# Altium schematic sheet EC_Circuit4-4-2016.SchDoc
size A
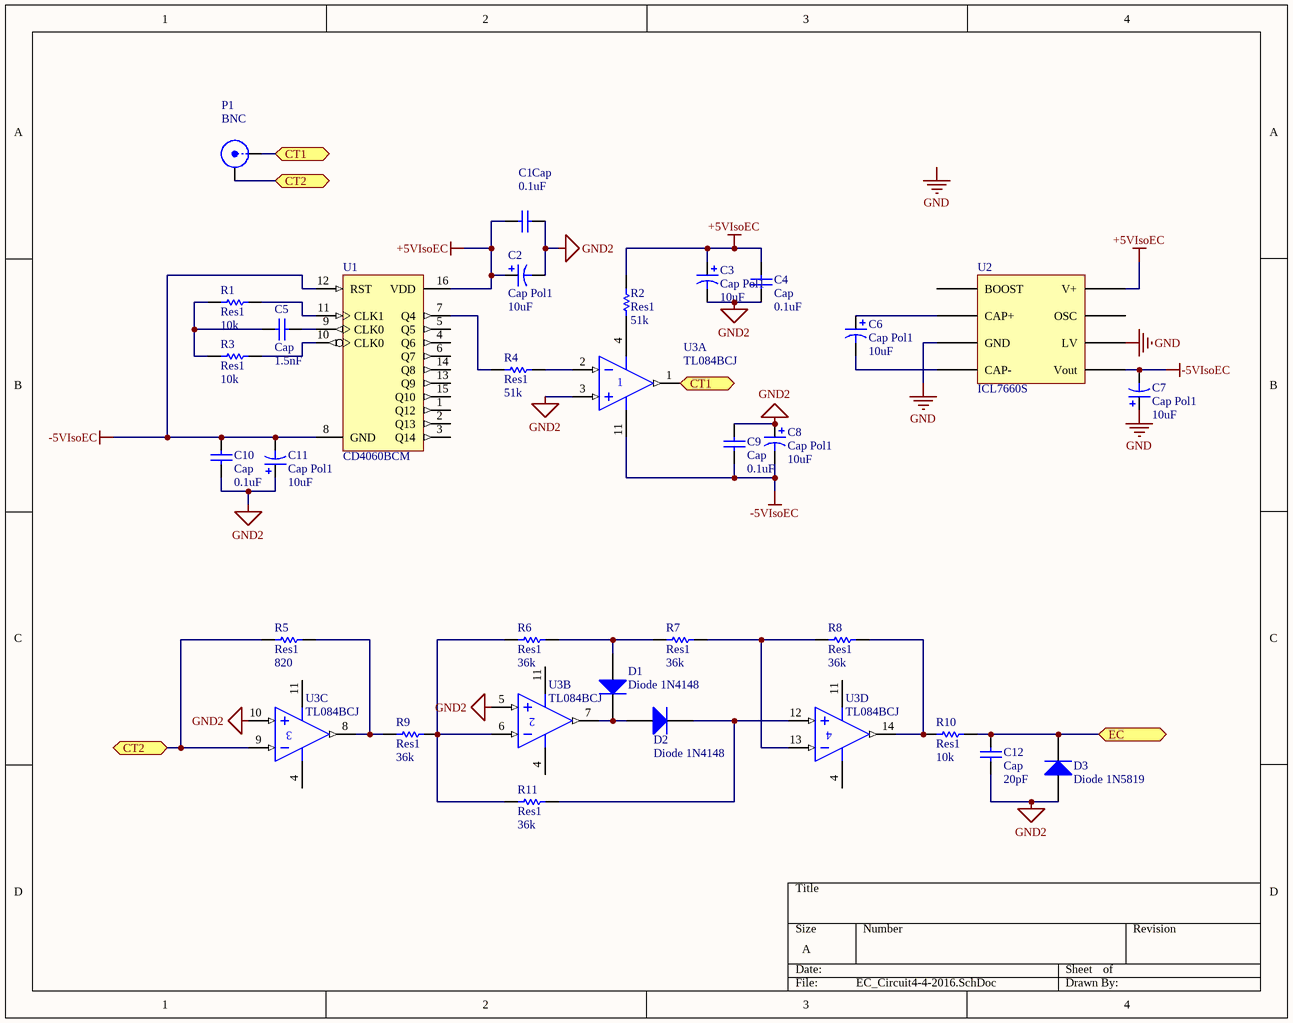
[diagram p0: EC_Circuit4-4-2016.SchDoc]

## Parts
C1  Cap  value 0.1uF  [RESC2012L]
C2  Cap Pol1  value 10uF  [CAPC3216L]
C3  Cap Pol1  value 10uF  [CAPC3216L]
C4  Cap  value 0.1uF  [RESC2012L]
C5  Cap  value 1.5nF  [RESC2012L]
C6  Cap Pol1  value 10uF  [CAPC3216L]
C7  Cap Pol1  value 10uF  [CAPC3216L]
C8  Cap Pol1  value 10uF  [CAPC3216L]
C9  Cap  value 0.1uF  [RESC2012L]
C10  Cap  value 0.1uF  [RESC2012L]
C11  Cap Pol1  value 10uF  [CAPC3216L]
C12  Cap  value 20pF  [RESC2012L]
D1  Diode 1N4148  [SOD123/X.85]
D2  Diode 1N4148  [SOD123/X.85]
D3  Diode 1N5819  [SOD123/X.85]
P1  BNC  [BNC_RA CON]
R1  Res1  value 10k  [RESC2012L]
R2  Res1  value 51k  [RESC2012L]
R3  Res1  value 10k  [RESC2012L]
R4  Res1  value 51k  [RESC2012L]
R5  Res1  value 820  [RESC2012L]
R6  Res1  value 36k  [RESC2012L]
R7  Res1  value 36k  [RESC2012L]
R8  Res1  value 36k  [RESC2012L]
R9  Res1  value 36k  [RESC2012L]
R10  Res1  value 10k  [RESC2012L]
R11  Res1  value 36k  [RESC2012L]
U1  CD4060BCM  [M16A_N]
U2  ICL7660S  [SOIC127P600-8M]
U3  TL084BCJ  [NSO14_M]  (parts A,B,C,D of 4)

## Ports
CT1, CT2, EC

## Nets
+5VIsoEC: C1.1 C2.1 C3.1 C4.1 R2.2 U1.16(VDD) U2.8(V+)
-5VIsoEC: C7.2 C8.2 C9.2 C10.2 C11.2 U1.8(GND) U1.12(RST) U2.5(Vout) U3.11(V-)
GND: C7.1 U2.3(GND) U2.6(LV)
GND2: C1.2 C2.2 C3.2 C4.2 C8.1 C9.1 C10.1 C11.1 C12.2 D3.1(A) U3.3(IN+) U3.5(IN+) U3.10(IN+)
CT1: P1.1(X) U3.1(OUT) ; port CT1
CT2: P1.2(Y) R5.1 U3.9(IN-) ; port CT2
EC: C12.1 D3.2(K) R10.2 ; port EC
NetC5_1: C5.1 R1.1 R3.1
NetC5_2: C5.2 U1.9(CLK0)
NetC6_1: C6.1 U2.2(CAP+)
NetC6_2: C6.2 U2.4(CAP-)
NetD1_1: D1.1(A) R6.2 R7.1
NetD1_2: D1.2(K) D2.1(A) U3.7(OUT)
NetD2_2: D2.2(K) R11.2 U3.12(IN+)
NetR1_2: R1.2 U1.11(CLK1)
NetR2_1: R2.1 U3.4(V+)
NetR3_2: R3.2 U1.10(CLK0)
NetR4_1: R4.1 U1.7(Q4)
NetR4_2: R4.2 U3.2(IN-)
NetR5_2: R5.2 R9.1 U3.8(OUT)
NetR6_1: R6.1 R9.2 R11.1 U3.6(IN-)
NetR7_2: R7.2 R8.1 U3.13(IN-)
NetR8_2: R8.2 R10.1 U3.14(OUT)

Not connected (* = marked no-connect by the designer): U1 1(Q12) 2(Q13) 3(Q14) 4(Q6) 5(Q5) 6(Q7) 13(Q9) 14(Q8) 15(Q10); U2 1(BOOST) 7(OSC)

## Notes on the sheet
- Labels drawn without touching a wire or pin: GND

## Library data of the parts
C1 C4 C5 C9 C10 C12 = Cap: Capacitor; Published: 8-Jun-2000; LatestRevisionDate: 17-Jul-2002; LatestRevisionNote: Re-released for DXP Platform.; PackageReference: RAD-0.3; Publisher: Altium Limited
C2 C3 C6-C8 C11 = Cap Pol1: Polarized Capacitor (Radial); Published: 8-Jun-2000; LatestRevisionDate: 17-Jul-2002; LatestRevisionNote: Re-released for DXP Platform.; PackageReference: RB7.6-15; Publisher: Altium Limited
D1 D2 = Diode 1N4148: High Conductance Fast Diode; Published: 8-Jun-2000; LatestRevisionDate: 17-Jul-2002; LatestRevisionNote: Re-released for DXP Platform.; DatasheetVersion: 1997; PackageReference: DO-35; Publisher: Altium Limited; Code_JEDEC: DO-204-AH; ComponentLink1Description: Manufacturer Link; ComponentLink1URL: http://www.fairchildsemi.com/; ComponentLink2Description: Datasheet; ComponentLink2URL: http://www.fairchildsemi.com/ds/1N%2F1N4148.pdf
D3 = Diode 1N4001: 1 Amp General Purpose Rectifier; Published: 8-Jun-2000; LatestRevisionDate: 17-Jul-2002; LatestRevisionNote: Re-released for DXP Platform.; DatasheetVersion: 1998; PackageVersion: Aug-1999; PackageReference: DO-41; Publisher: Altium Limited; Code_JEDEC: DO-204-AL; ComponentLink1Description: Manufacturer Link; ComponentLink1URL: http://www.fairchildsemi.com/; ComponentLink2Description: Datasheet; ComponentLink2URL: http://www.fairchildsemi.com/ds/1N%2F1N4001.pdf
P1 = BNC: BNC Elbow Connector; LatestRevisionDate: 17-Jul-2002; LatestRevisionNote: Re-released for DXP Platform.; Publisher: Altium Limited
R1-R11 = Res1: Resistor; Published: 8-Jun-2000; LatestRevisionDate: 17-Jul-2002; LatestRevisionNote: Re-released for DXP Platform.; PackageReference: AXIAL-0.3; Publisher: Altium Limited
U1 = CD4060BCM: 14-Stage Ripple Carry Binary Counter; Published: 17-Jul-2002; LatestRevisionDate: 13-Apr-2006; LatestRevisionNote: IPC-7351 Footprint Added.; DatasheetVersion: Jan-1999; PackageVersion: 2000; PackageReference: M16A; Publisher: Altium Limited; PackageDescription: 16-Pin Small Outline Integrated Circuit 1.27 mm Pitch; Code_IPC: SOIC127P600-16; ComponentLink1Description: Manufacturer Link; ComponentLink1URL: http://www.fairchildsemi.com/; ComponentLink2Description: Datasheet; ComponentLink2URL: http://www.fairchildsemi.com/ds/CD%2FCD4040BC.pdf
U3 = TL084BCJ: JFET-Input Operational Amplifier; Published: 17-Jul-2002; LatestRevisionDate: 06-Jun-2005; LatestRevisionNote: Stylized 3D Model Added.; DatasheetVersion: 1988; PackageReference: 632-08; Publisher: Altium Limited; PackageDescription: DIP; 14 Leads; Row Spacing 7.62 mm; Pitch 2.54 mm; ComponentLink1Description: Manufacturer Link; ComponentLink1URL: http://www.onsemi.com/site/products/parametrics/0,4446,251,00.html